# Altium schematic sheet cell_adaptor.SchDoc
size A3; SheetNumber: 1; SheetTotal: 1
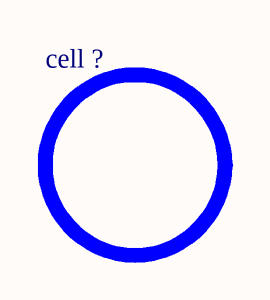
[diagram p0: cell_adaptor.SchDoc]

## Parts
cell_?  cell terminal  [cell terminal]  (value not drawn)

## Notes on the sheet
- Title:
- Size:
- Drawn By:
- Page Contents:
- Number:
- Checked By:
- Revision:
- Date:
- License:
- Email:
- Time:
- Sheet
- Website:
- of